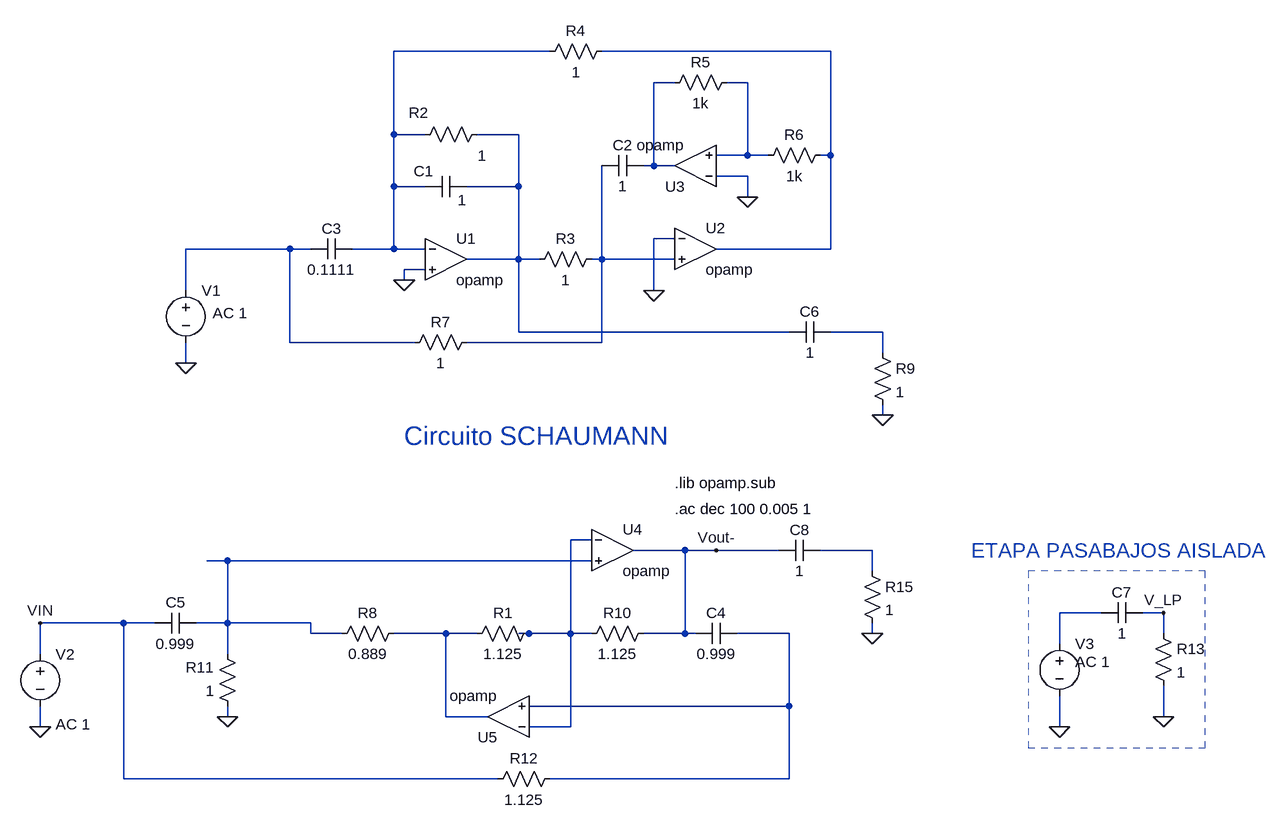
[diagram p0: schematic notch_pb.asc]
notch_pb.asc, the LTspice schematic file:
Version 4
SHEET 1 2900 1140
WIRE 416 -864 176 -864
WIRE 848 -864 496 -864
WIRE 608 -816 576 -816
WIRE 720 -816 688 -816
WIRE 176 -736 176 -864
WIRE 224 -736 176 -736
WIRE 368 -736 304 -736
WIRE 720 -704 720 -816
WIRE 720 -704 672 -704
WIRE 752 -704 720 -704
WIRE 848 -704 848 -864
WIRE 848 -704 832 -704
WIRE 576 -688 576 -816
WIRE 576 -688 560 -688
WIRE 608 -688 576 -688
WIRE 720 -672 672 -672
WIRE 176 -656 176 -736
WIRE 224 -656 176 -656
WIRE 368 -656 368 -736
WIRE 368 -656 288 -656
WIRE 720 -640 720 -672
WIRE 608 -576 576 -576
WIRE 16 -560 -144 -560
WIRE 48 -560 16 -560
WIRE 176 -560 176 -656
WIRE 176 -560 112 -560
WIRE 224 -560 176 -560
WIRE 848 -560 848 -704
WIRE 848 -560 672 -560
WIRE 368 -544 368 -656
WIRE 368 -544 288 -544
WIRE 400 -544 368 -544
WIRE 496 -544 496 -688
WIRE 496 -544 480 -544
WIRE 608 -544 496 -544
WIRE 224 -528 192 -528
WIRE 192 -512 192 -528
WIRE -144 -496 -144 -560
WIRE 576 -496 576 -576
WIRE 368 -432 368 -544
WIRE 784 -432 368 -432
WIRE 928 -432 848 -432
WIRE 16 -416 16 -560
WIRE 208 -416 16 -416
WIRE 496 -416 496 -544
WIRE 496 -416 288 -416
WIRE 928 -400 928 -432
WIRE -144 -384 -144 -416
WIRE 928 -304 928 -320
WIRE 480 -112 448 -112
WIRE 624 -96 544 -96
WIRE 672 -96 624 -96
WIRE 768 -96 672 -96
WIRE 912 -96 832 -96
WIRE -80 -80 -112 -80
WIRE 480 -80 -80 -80
WIRE 912 -64 912 -96
WIRE 1264 0 1200 0
WIRE 1360 0 1328 0
WIRE -240 16 -368 16
WIRE -192 16 -240 16
WIRE -80 16 -80 -80
WIRE -80 16 -128 16
WIRE 48 16 -80 16
WIRE 48 32 48 16
WIRE 96 32 48 32
WIRE 256 32 176 32
WIRE 304 32 256 32
WIRE 384 32 368 32
WIRE 448 32 448 -112
WIRE 448 32 384 32
WIRE 480 32 448 32
WIRE 624 32 624 -96
WIRE 624 32 560 32
WIRE 640 32 624 32
WIRE 784 32 704 32
WIRE 912 32 912 16
WIRE 1360 32 1360 0
WIRE 1200 48 1200 0
WIRE -368 64 -368 16
WIRE -80 64 -80 16
WIRE 784 144 784 32
WIRE 784 144 384 144
WIRE -80 160 -80 144
WIRE 256 160 256 32
WIRE 320 160 256 160
WIRE 1360 160 1360 112
WIRE -368 176 -368 144
WIRE 448 176 448 32
WIRE 448 176 384 176
WIRE 1200 176 1200 128
WIRE -240 256 -240 16
WIRE 336 256 -240 256
WIRE 784 256 784 144
WIRE 784 256 416 256
FLAG 720 -640 0
FLAG 576 -496 0
FLAG 192 -512 0
FLAG -144 -384 0
FLAG -80 160 0
FLAG -368 176 0
FLAG 1200 176 0
FLAG 1360 160 0
FLAG 1360 0 V_LP
FLAG 672 -96 Vout-
FLAG -368 16 VIN
FLAG 912 32 0
FLAG 928 -304 0
SYMBOL res 320 -752 R90
WINDOW 0 -2 106 VBottom 2
WINDOW 3 33 8 VTop 2
SYMATTR InstName R2
SYMATTR Value 1
SYMBOL res 496 -560 R90
WINDOW 0 0 56 VBottom 2
WINDOW 3 32 56 VTop 2
SYMATTR InstName R3
SYMATTR Value 1
SYMBOL res 512 -880 R90
WINDOW 0 0 56 VBottom 2
WINDOW 3 32 56 VTop 2
SYMATTR InstName R4
SYMATTR Value 1
SYMBOL res 704 -832 R90
WINDOW 0 0 56 VBottom 2
WINDOW 3 32 56 VTop 2
SYMATTR InstName R5
SYMATTR Value 1k
SYMBOL res 848 -720 R90
WINDOW 0 0 56 VBottom 2
WINDOW 3 32 56 VTop 2
SYMATTR InstName R6
SYMATTR Value 1k
SYMBOL cap 288 -672 R90
WINDOW 0 8 66 VBottom 2
WINDOW 3 21 7 VTop 2
SYMATTR InstName C1
SYMATTR Value 1
SYMBOL cap 560 -704 R90
WINDOW 0 0 32 VBottom 2
WINDOW 3 32 32 VTop 2
SYMATTR InstName C2
SYMATTR Value 1
SYMBOL Opamps\\opamp 256 -608 R0
SYMATTR InstName U1
SYMBOL Opamps\\opamp 640 -624 R0
SYMATTR InstName U2
SYMBOL Opamps\\opamp 640 -624 R180
SYMATTR InstName U3
SYMBOL voltage -144 -512 R0
WINDOW 3 24 152 Left 2
WINDOW 123 41 51 Left 2
WINDOW 39 0 0 Left 2
SYMATTR Value ""
SYMATTR Value2 AC 1
SYMATTR InstName V1
SYMBOL res 304 -432 R90
WINDOW 0 0 56 VBottom 2
WINDOW 3 32 56 VTop 2
SYMATTR InstName R7
SYMATTR Value 1
SYMBOL cap 112 -576 R90
WINDOW 0 0 32 VBottom 2
WINDOW 3 32 32 VTop 2
SYMATTR InstName C3
SYMATTR Value 0.1111
SYMBOL res 192 16 R90
WINDOW 0 0 56 VBottom 2
WINDOW 3 32 56 VTop 2
SYMATTR InstName R8
SYMATTR Value 0.889
SYMBOL res 576 16 R90
WINDOW 0 0 56 VBottom 2
WINDOW 3 32 56 VTop 2
SYMATTR InstName R10
SYMATTR Value 1.125
SYMBOL res -64 160 R180
WINDOW 0 36 76 Left 2
WINDOW 3 36 40 Left 2
SYMATTR InstName R11
SYMATTR Value 1
SYMBOL cap -128 0 R90
WINDOW 0 0 32 VBottom 2
WINDOW 3 32 32 VTop 2
SYMATTR InstName C5
SYMATTR Value 0.999
SYMBOL opamp 512 -160 R0
SYMATTR InstName U4
SYMBOL opamp 352 224 R180
SYMATTR InstName U5
SYMBOL res 432 240 R90
WINDOW 0 0 56 VBottom 2
WINDOW 3 32 56 VTop 2
SYMATTR InstName R12
SYMATTR Value 1.125
SYMBOL voltage -368 48 R0
WINDOW 123 24 124 Left 2
WINDOW 39 0 0 Left 2
SYMATTR Value2 AC 1
SYMATTR InstName V2
SYMATTR Value ""
SYMBOL cap 1328 -16 R90
WINDOW 0 0 32 VBottom 2
WINDOW 3 32 32 VTop 2
SYMATTR InstName C7
SYMATTR Value 1
SYMBOL res 1344 16 R0
SYMATTR InstName R13
SYMATTR Value 1
SYMBOL voltage 1200 32 R0
WINDOW 123 24 44 Left 2
WINDOW 39 0 0 Left 2
SYMATTR Value2 AC 1
SYMATTR InstName V3
SYMATTR Value ""
SYMBOL cap 832 -112 R90
WINDOW 0 0 32 VBottom 2
WINDOW 3 32 32 VTop 2
SYMATTR InstName C8
SYMATTR Value 1
SYMBOL res 896 -80 R0
SYMATTR InstName R15
SYMATTR Value 1
SYMBOL cap 704 16 R90
WINDOW 0 0 32 VBottom 2
WINDOW 3 32 32 VTop 2
SYMATTR InstName C4
SYMATTR Value 0.999
SYMBOL res 400 16 R90
WINDOW 0 0 56 VBottom 2
WINDOW 3 32 56 VTop 2
SYMATTR InstName R1
SYMATTR Value 1.125
SYMBOL res 912 -416 R0
SYMATTR InstName R9
SYMATTR Value 1
SYMBOL cap 848 -448 R90
WINDOW 0 0 32 VBottom 2
WINDOW 3 32 32 VTop 2
SYMATTR InstName C6
SYMATTR Value 1
TEXT 608 -200 Left 2 !.lib opamp.sub
TEXT 608 -160 Left 2 !.ac dec 100 0.005 1
TEXT 192 -272 Left 4 ;Circuito SCHAUMANN
TEXT 1064 -96 Left 3 ;ETAPA PASABAJOS AISLADA
RECTANGLE Normal 1424 -64 1152 208 1

The netlist it stands for:
* notch_pb.asc
R2 N005 N001 1
R3 N007 N005 1
R4 N002 N001 1
R5 N004 N003 1k
R6 N002 N004 1k
C1 N005 N001 1
C2 N003 N007 1
XU1 N001 0 N005 opamp Aol=100K GBW=10Meg  ; pins invin noninvin out
XU2 0 N007 N002 opamp Aol=100K GBW=10Meg  ; pins invin noninvin out
XU3 0 N004 N003 opamp Aol=100K GBW=10Meg  ; pins invin noninvin out
V1 N006 0 AC 1
R7 N007 N006 1
C3 N001 N006 0.1111
R8 N013 N011 0.889
R10 Vout- N009 1.125
R11 0 N011 1
C5 N011 VIN 0.999
XU4 N009 N011 Vout- opamp Aol=100K GBW=10Meg  ; pins invin noninvin out
XU5 N009 N014 N013 opamp Aol=100K GBW=10Meg  ; pins invin noninvin out
R12 N014 VIN 1.125
V2 VIN 0 AC 1
C7 V_LP N012 1
R13 V_LP 0 1
V3 N012 0 AC 1
C8 N010 Vout- 1
R15 N010 0 1
C4 N014 Vout- 0.999
R1 N009 N013 1.125
R9 N008 0 1
C6 N008 N005 1
.lib opamp.sub
.ac dec 100 0.005 1
* Circuito SCHAUMANN
* ETAPA PASABAJOS AISLADA
.backanno
.end